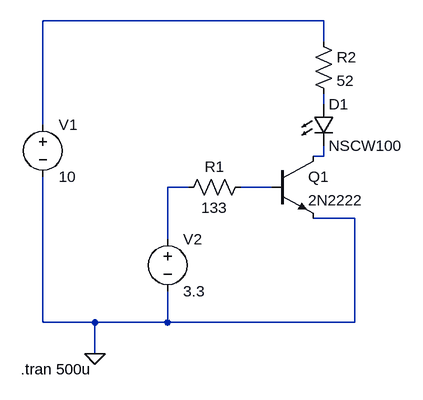
[diagram p0: schematic follower-emiter.asc]
follower-emiter.asc, the LTspice schematic file:
Version 4
SHEET 1 880 680
WIRE 320 -48 -112 -48
WIRE 320 -16 320 -48
WIRE 320 80 320 64
WIRE -112 112 -112 -48
WIRE 320 160 320 144
WIRE 320 160 304 160
WIRE 112 208 80 208
WIRE 240 208 192 208
WIRE 368 256 304 256
WIRE 80 288 80 208
WIRE -112 416 -112 192
WIRE -32 416 -112 416
WIRE 80 416 80 368
WIRE 80 416 -32 416
WIRE 368 416 368 256
WIRE 368 416 80 416
WIRE -32 464 -32 416
FLAG -32 464 0
SYMBOL voltage -112 96 R0
WINDOW 123 0 0 Left 2
WINDOW 39 0 0 Left 2
SYMATTR InstName V1
SYMATTR Value 10
SYMBOL voltage 80 272 R0
WINDOW 123 0 0 Left 2
WINDOW 39 0 0 Left 2
SYMATTR InstName V2
SYMATTR Value 3.3
SYMBOL npn 240 160 R0
SYMATTR InstName Q1
SYMATTR Value 2N2222
SYMBOL res 208 192 R90
WINDOW 0 0 56 VBottom 2
WINDOW 3 32 56 VTop 2
SYMATTR InstName R1
SYMATTR Value 133
SYMBOL LED 304 80 R0
SYMATTR InstName D1
SYMATTR Value NSCW100
SYMATTR Description Diode
SYMATTR Type diode
SYMBOL res 304 -32 R0
SYMATTR InstName R2
SYMATTR Value 52
TEXT -146 488 Left 2 !.tran 500u

The netlist it stands for:
* follower-emiter.asc
V1 N001 0 10
V2 N004 0 3.3
Q1 N003 N005 0 0 2N2222
R1 N005 N004 133
D1 N002 N003 NSCW100
R2 N001 N002 52
.model D D
.lib standard.dio
.model NPN NPN
.model PNP PNP
.lib standard.bjt
.tran 500u
.backanno
.end